# Altium schematic sheet POWER_MUX.SchDoc
size A4
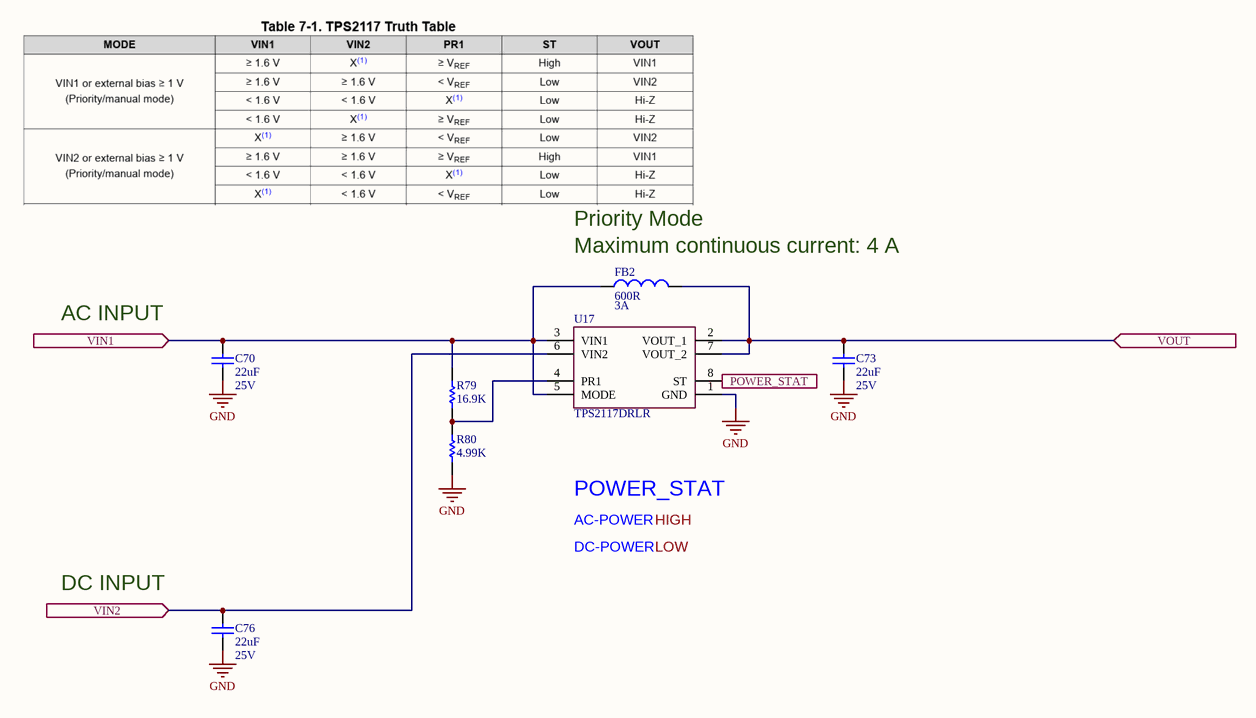
[diagram p0: POWER_MUX.SchDoc]

## Parts
C70  value 22uF  Voltage: 25V  [CAP_0805]  (hidden comment: CL21A226MAYNNNE)
C73  value 22uF  Voltage: 25V  [CAP_0805]  (hidden comment: CL21A226MAYNNNE)
C76  value 22uF  Voltage: 25V  [CAP_0805]  (hidden comment: CL21A226MAYNNNE)
FB2  value 600R  Current: 3A  [BEADC3225X280N]  (hidden comment: FBMH3225HM601NT)
R79  value 16.9K  [RES_0603]  (hidden comment: 0603SAF1692T5E)
R80  value 4.99K  [RES_0603]  (hidden comment: 0603SAF4991T5E)
U17  TPS2117DRLR  [SOTFL50P160X60-8N]

## Ports
POWER_STAT (in), VIN1 (in), VIN2 (in), VOUT (in)

## Nets
GND: C70.2 C73.2 C76.2 R80.1 U17.1(GND)
POWER_STAT: U17.8(ST) ; port POWER_STAT
VIN1: C70.1 FB2.1 R79.2 U17.3(VIN1) U17.5(MODE) ; port VIN1
VIN2: C76.1 U17.6(VIN2) ; port VIN2
VOUT: C73.1 FB2.2 U17.2(VOUT_1) U17.7(VOUT_2) ; port VOUT
NetR79_1: R79.1 R80.2 U17.4(PR1)

## Notes on the sheet
- (near FB2) Maximum continuous current: 4 A
- Priority Mode
- AC INPUT
- POWER_STAT
- AC-POWER
- DC-POWER
- HIGH
- LOW
- DC INPUT
- Title
- Size:
- Date:
- A4
- Number:
- Time:
- Revision:
- Sheet
- of
- Drawn by:

## Library data of the parts
C70 C73 C76 = C01760: CAP CER 22UF 25V X5R 0805; Manufacturer: Samsung; Manufacturer Part Number: CL21A226MAYNNNE
FB2 = IND0000023: FERRITE BEAD 1210 600R 3A SMD; Manufacturer: Taiyo Yuden; Manufacturer Part Number: FBMH3225HM601NT
R79 = R03000: RES.(1608) 0603 16.9K Ohms 1% 1/10W-S 100PPM; Manufacturer: ROYALOHM; Manufacturer Part Number: 0603SAF1692T5E
R80 = R03000: RES.(1608) 0603 4.99K Ohms 1% 1/10W-S 100PPM; Manufacturer: ROYALOHM; Manufacturer Part Number: 0603SAF4991T5E
U17 = TPS2117DRLR: 1.6-V TO 5.5-V, 20-M, 4-A LOW IQ; Manufacturer: Texas Instruments; Manufacturer Part Number: TPS2117DRLR